# EAGLE design LTC3110 (EAGLE 7.1.0)
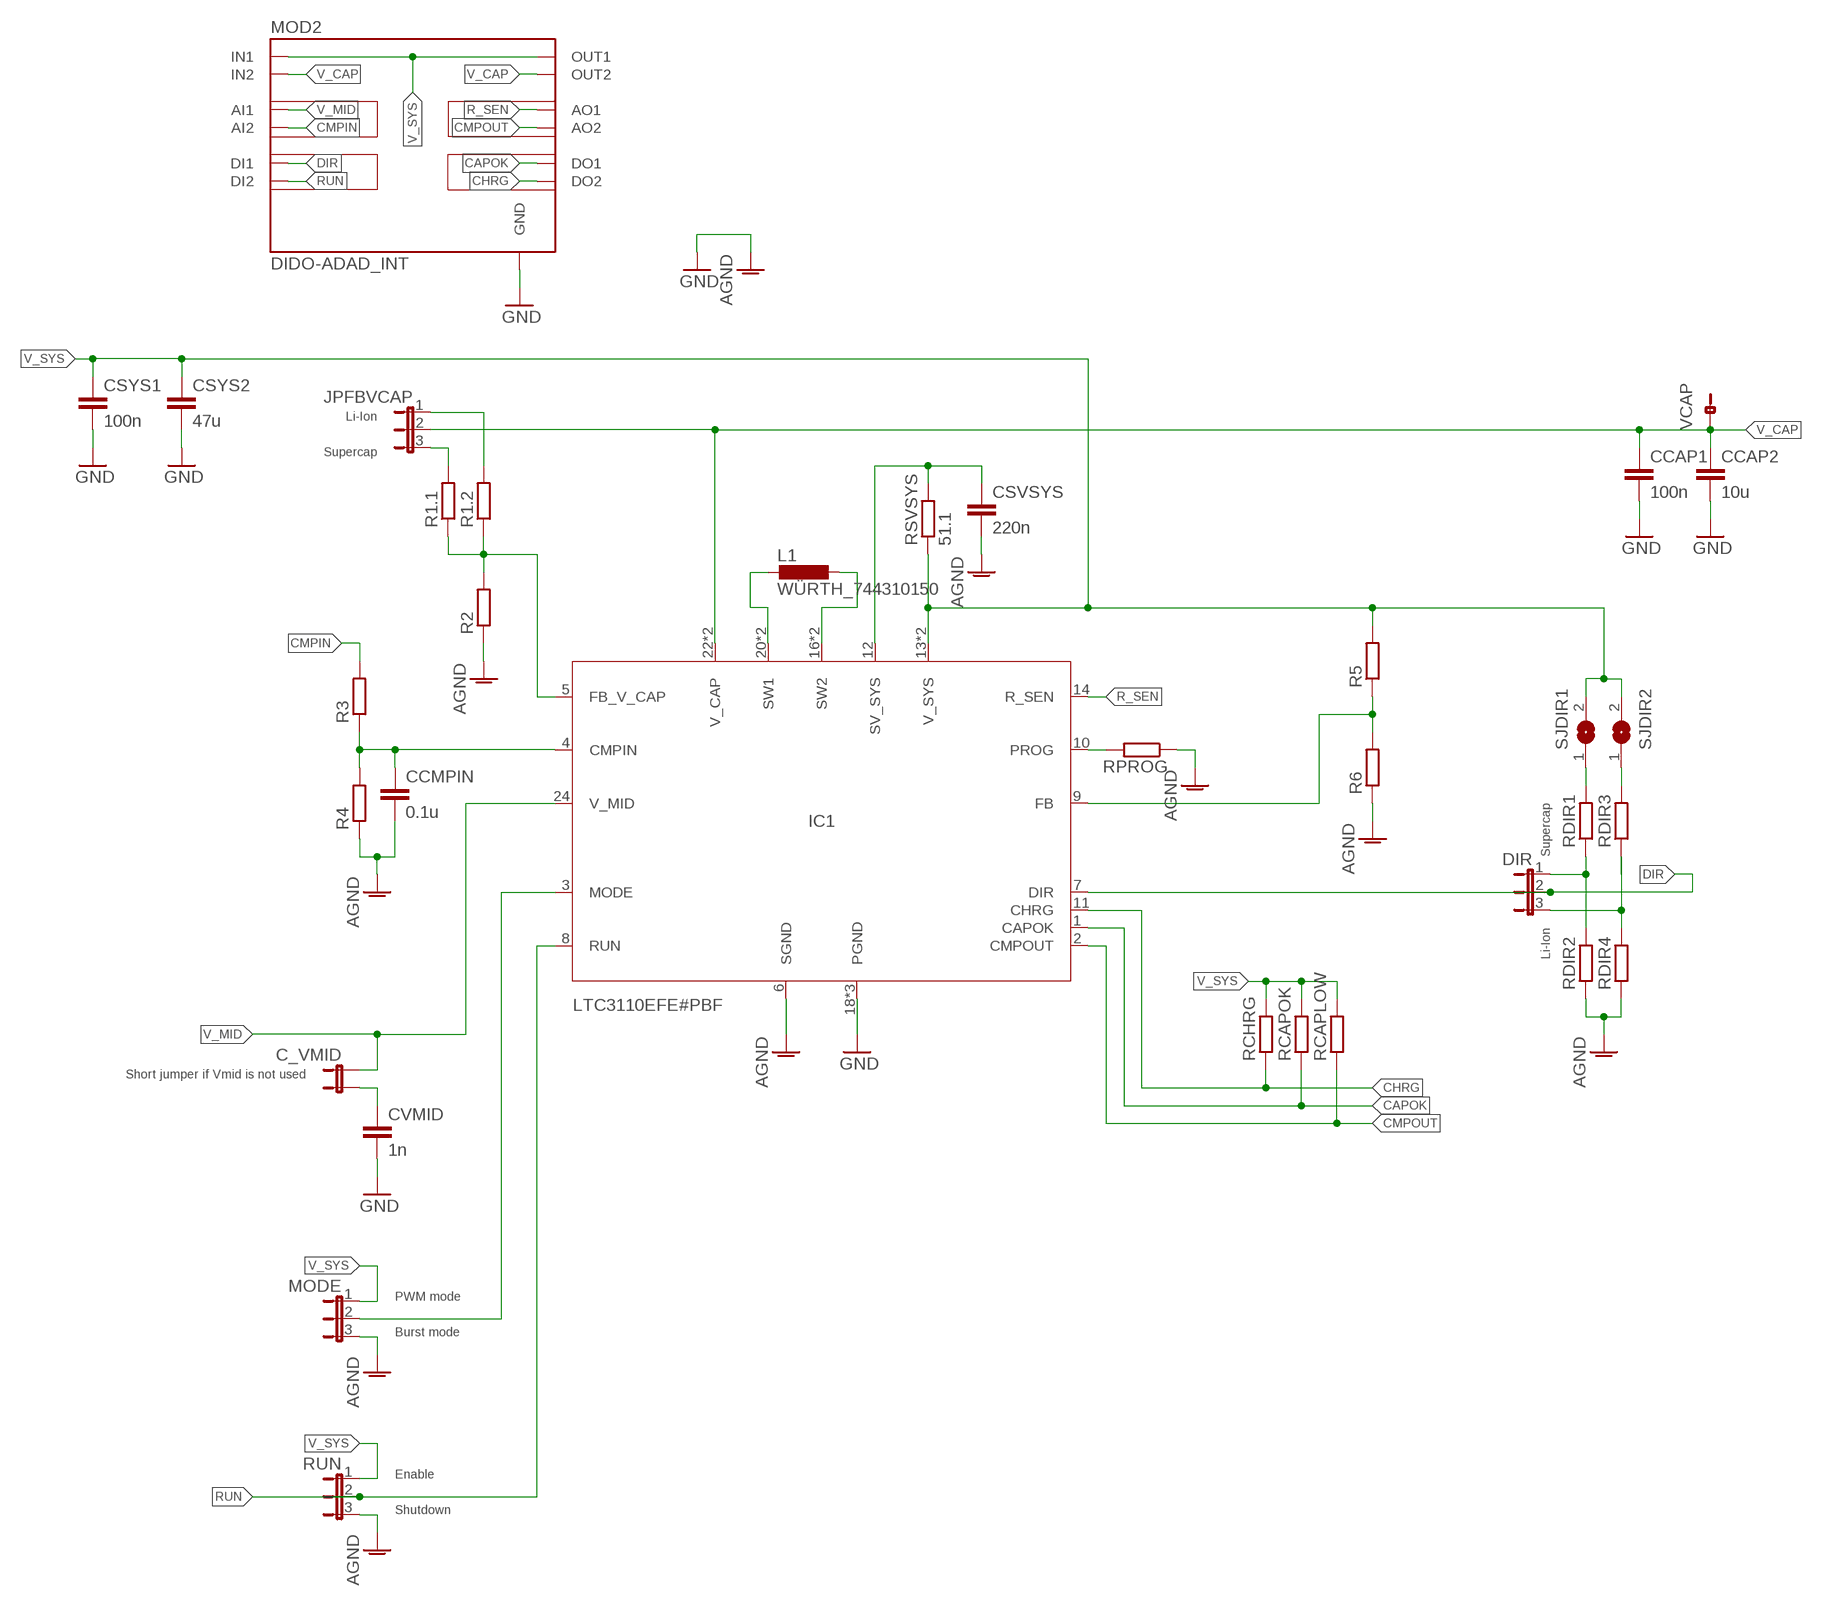
[diagram p0: schematic, sheet 1]

## Parts
C_VMID  JP2_SMALL_PAD  [JP2_SMALL_PAD]
CCAP1  100n  C-EUC0805  [C0805]
CCAP2  10u  C-EUC0805  [C0805]
CCMPIN  0.1u  C-EUC0805  [C0805]
CSVSYS  220n  C-EUC0805  [C0805]
CSYS1  100n  C-EUC0805  [C0805]
CSYS2  47u  C-EUC0805  [C0805]
CVMID  1n  C-EUC0805  [C0805]
DIR  JP3_SMALL_PAD  [JP3_SMALL_PAD]
IC1  LTC3110EFE#PBF  [TSSOP24-4,4MM]
JPFBVCAP  JP3_SMALL_PAD  [JP3_SMALL_PAD]
L1  WÜRTH_744310150  [WÜRTH_744310150]
MOD2  DIDO-ADAD_INT  [DIDO-ADAD]
MODE  JP3_SMALL_PAD  [JP3_SMALL_PAD]
R1.1  R-EU_R0805  [R0805]
R1.2  R-EU_R0805  [R0805]
R2  R-EU_R0805  [R0805]
R3  R-EU_R0805  [R0805]
R4  R-EU_R0805  [R0805]
R5  R-EU_R0805  [R0805]
R6  R-EU_R0805  [R0805]
RCAPLOW  R-EU_R0805  [R0805]
RCAPOK  R-EU_R0805  [R0805]
RCHRG  R-EU_R0805  [R0805]
RDIR1  R-EU_R0805  [R0805]
RDIR2  R-EU_R0805  [R0805]
RDIR3  R-EU_R0805  [R0805]
RDIR4  R-EU_R0805  [R0805]
RPROG  R-EU_R0805  [R0805]
RSVSYS  51.1  R-EU_R0805  [R0805]
RUN  JP3_SMALL_PAD  [JP3_SMALL_PAD]
SJDIR1  SJ2  [SJ2]
SJDIR2  SJ2  [SJ2]
VCAP  JPO  [JP0]

## Nets
AGND: CCMPIN.2 CSVSYS.2 IC1.6(SGND) MODE.3 R2.1 R4.1 R6.1 RDIR2.1 RDIR4.1 RPROG.1 RUN.3
CAPOK: IC1.1(CAPOK) MOD2.DO1 RCAPOK.1
CHRG: IC1.11(CHRG) MOD2.DO2 RCHRG.1
CMPIN: MOD2.AI2 R3.2
CMPOUT: IC1.2(CMPOUT) MOD2.AO2 RCAPLOW.1
DIR: DIR.2 IC1.7(DIR) MOD2.DI1
FB_V_CAP: IC1.5(FB_V_CAP) R1.1.1 R1.2.1 R2.2
GND: CCAP1.2 CCAP2.2 CSYS1.2 CSYS2.2 CVMID.2 IC1.18(PGND) IC1.19(PGND) IC1.TAB(PGND) MOD2.GND1(GND) MOD2.GND2(GND) MOD2.GND3(GND) MOD2.GND4(GND) ; supply symbol labelled AGND
MODE: IC1.3(MODE) MODE.2
N$1: C_VMID.2 CVMID.1
N$2: IC1.9(FB) R5.1 R6.2
N$3: CCMPIN.1 IC1.4(CMPIN) R3.1 R4.2
N$5: CSVSYS.1 IC1.12(SV_SYS) RSVSYS.2
N$6: DIR.3 RDIR3.1 RDIR4.2
N$7: IC1.20(SW1) IC1.21(SW1) L1.P$1
N$8: IC1.16(SW2) IC1.17(SW2) L1.P$2
N$9: IC1.10(PROG) RPROG.2
N$11: JPFBVCAP.3 R1.1.2
N$13: DIR.1 RDIR1.1 RDIR2.2
N$14: JPFBVCAP.1 R1.2.2
N$15: RDIR1.2 SJDIR1.1
N$16: RDIR3.2 SJDIR2.1
R_SEN: IC1.14(R_SEN) MOD2.AO1
RUN: IC1.8(RUN) MOD2.DI2 RUN.2
V_CAP: CCAP1.1 CCAP2.1 IC1.22(V_CAP) IC1.23(V_CAP) JPFBVCAP.2 MOD2.IN2_1(IN2) MOD2.IN2_2(IN2) MOD2.IN2_3(IN2) MOD2.IN2_4(IN2) MOD2.OUT2_1(OUT2) MOD2.OUT2_2(OUT2) MOD2.OUT2_3(OUT2) MOD2.OUT2_4(OUT2) VCAP.1
V_MID: C_VMID.1 IC1.24(V_MID) MOD2.AI1
V_SYS: CSYS1.1 CSYS2.1 IC1.13(V_SYS) IC1.15(V_SYS) MOD2.IN1_1(IN1) MOD2.IN1_2(IN1) MOD2.IN1_3(IN1) MOD2.IN1_4(IN1) MOD2.OUT1_1(OUT1) MOD2.OUT1_2(OUT1) MOD2.OUT1_3(OUT1) MOD2.OUT1_4(OUT1) MODE.1 R5.2 RCAPLOW.2 RCAPOK.2 RCHRG.2 RSVSYS.1 RUN.1 SJDIR1.2 SJDIR2.2

## Notes on the sheet
- Li-Ion
- Supercap
- Supercap
- Li-Ion
- Short jumper if Vmid is not used
- PWM mode
- Burst mode
- Enable
- Shutdown

## Library data of the parts
C_VMID = Jumper_mod:JP2_SMALL_PAD
CCAP1 CCAP2 CCMPIN CSVSYS CSYS1 CSYS2 CVMID = rcl:C-EU: CAPACITOR, European symbol
DIR JPFBVCAP MODE RUN = Jumper_mod:JP3_SMALL_PAD
IC1 = LTC3110:LTC3110EFE#PBF
L1 = Inductor:WÜRTH_744310150
MOD2 = AllModules:DIDO-ADAD_INT
R1.1 R1.2 R2-R6 RCAPLOW RCAPOK RCHRG RDIR1-RDIR4 RPROG RSVSYS = rcl:R-EU_: RESISTOR, European symbol
SJDIR1 SJDIR2 = Jumper_mod:SJ2: SMD solder JUMPER
VCAP = Jumper_mod:JPO

## Board
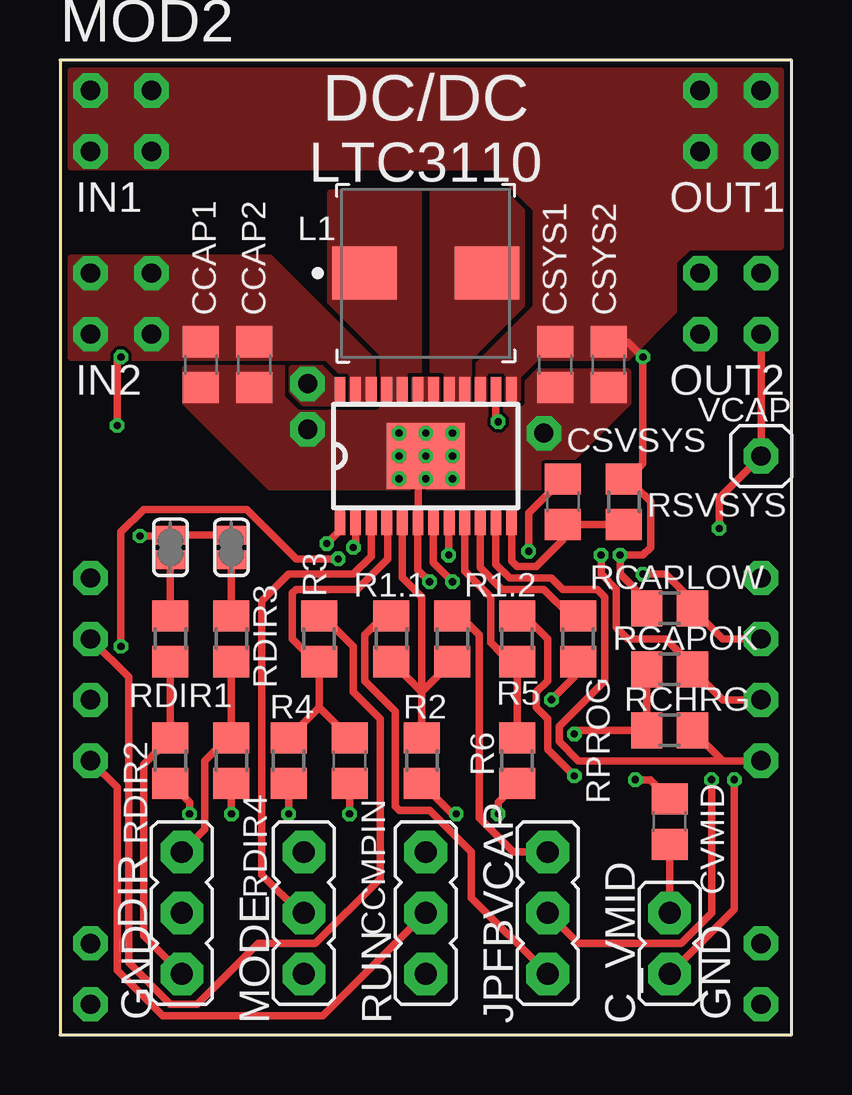
[diagram p1: board, top side]
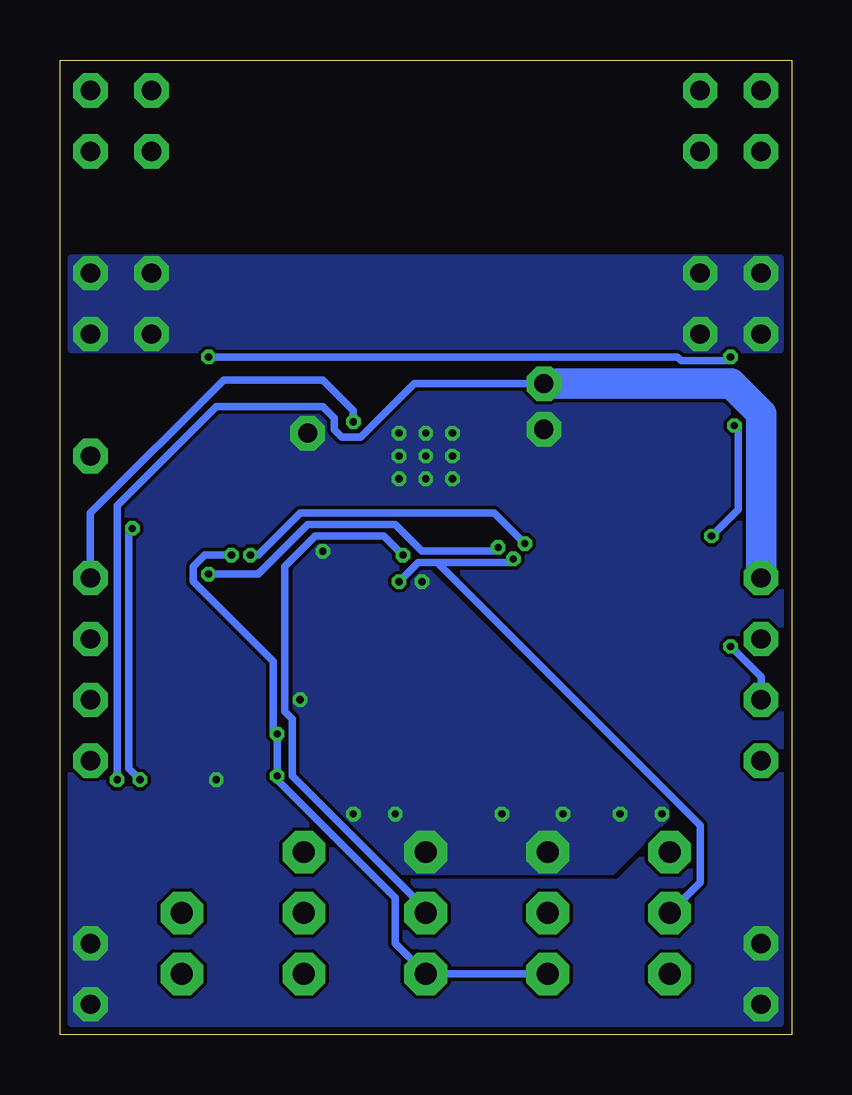
[diagram p2: board, bottom side, seen from below]

Size 30.48 x 40.64 mm. Coordinates in mm from the lower left corner, seen from the top.
Outline: 0,0 30.48,0 30.48,40.64 0,40.64 0,0
Copper layers (1*16): Top 0.035mm / dielectric 1.5mm / Bottom 0.035mm
Design rules "PCB-POOL Standard": minimum track width 0.15mm, minimum drill 0.3mm, track to track 0.15mm, track to pad 0.15mm, pad to pad 0.15mm, via to via 0.15mm, smd to smd 0.15mm, copper to edge 0.3mm, drill to drill 0.2mm, minimum pad ring 0.2mm, minimum via ring 0.15mm, stop-mask expansion 0.075mm, vias tented up to drill 0mil, thermal gap 0.2mm

### Footprints (pad centres in the part's own frame; a part is rotated, then mirrored left to right if it is on the bottom)
JP2_SMALL_PAD = drill 0.914 pad 1.778 octagon: 1 -2.54,0; 2 0,0
C0805 = smd 1.3 x 1.5: 1 -0.95,0; 2 0.95,0
JP3_SMALL_PAD = drill 0.914 pad 1.778 octagon: 1 -2.54,0; 2 0,0; 3 2.54,0
TSSOP24-4,4MM = smd 1.05 x 0.45: 1 -2.775,3.575; 2 -2.775,2.925; 3 -2.775,2.275; 4 -2.775,1.625; 5 -2.775,0.975; 6 -2.775,0.325; 7 -2.775,-0.325; 8 -2.775,-0.975; 9 -2.775,-1.625; 10 -2.775,-2.275; 11 -2.775,-2.925; 12 -2.775,-3.575; 13 2.775,-3.575; 14 2.775,-2.925; 15 2.775,-2.275; 16 2.775,-1.625; 17 2.775,-0.975; 18 2.775,-0.325; 19 2.775,0.325; 20 2.775,0.975; 21 2.775,1.625; 22 2.775,2.275; 23 2.775,2.925; 24 2.775,3.575 | smd 2.74 x 3.24: TAB 0,0
WÜRTH_744310150 = smd 2.7 x 2.2: P$1 -2.55,0; P$2 2.55,0
DIDO-ADAD = drill 0.8 pad 1.422 octagon: AI1 0,-20.32; AI2 0,-22.86; AO1 27.94,-20.32; AO2 27.94,-22.86; DI1 0,-25.4; DI2 0,-27.94; DO1 27.94,-25.4; DO2 27.94,-27.94; GND1 0,-38.1; GND2 0,-35.56; GND3 27.94,-35.56; GND4 27.94,-38.1; IN1_1 0,0; IN1_2 0,-2.54; IN1_3 2.54,0; IN1_4 2.54,-2.54; IN2_1 0,-7.62; IN2_2 0,-10.16; IN2_3 2.54,-7.62; IN2_4 2.54,-10.16; OUT1_1 25.4,0; OUT1_2 25.4,-2.54; OUT1_3 27.94,0; OUT1_4 27.94,-2.54; OUT2_1 25.4,-7.62; OUT2_2 25.4,-10.16; OUT2_3 27.94,-7.62; OUT2_4 27.94,-10.16
R0805 = smd 1.3 x 1.5: 1 -0.95,0; 2 0.95,0
SJ2 = smd 0.762 x 1.27: 1 -0.508,0; 2 0.508,0
JP0 = drill 0.8 pad 1.44 octagon: 1 0,0

### Placement (x,y rotation side)
C_VMID  25.4,5.08 90 top
CCAP1  5.87,27.94 270 top
CCAP2  8.1,27.94 270 top
CCMPIN  12.06,11.43 270 top
CSVSYS  20.95,22.23 90 top
CSYS1  20.64,27.94 270 top
CSYS2  22.86,27.94 270 top
CVMID  25.4,8.89 90 top
DIR  5.08,5.08 90 top
IC1  15.24,24.13 90 top
JPFBVCAP  20.32,5.08 270 top
L1  15.24,31.75 0 top
MOD2  1.27,39.37 0 top
MODE  10.16,5.08 90 top
R1.1  13.81,16.51 90 top
R1.2  16.35,16.51 90 top
R2  15.08,11.43 90 top
R3  10.79,16.51 90 top
R4  9.53,11.43 90 top
R5  19.05,16.51 90 top
R6  19.05,11.43 90 top
RCAPLOW  25.4,17.78 180 top
RCAPOK  25.4,15.24 180 top
RCHRG  25.4,12.7 180 top
RDIR1  4.6,16.51 90 top
RDIR2  4.6,11.43 90 top
RDIR3  7.14,16.51 90 top
RDIR4  7.14,11.43 90 top
RPROG  21.59,16.51 90 top
RSVSYS  23.5,22.23 270 top
RUN  15.24,5.08 90 top
SJDIR1  4.6,20.32 90 top
SJDIR2  7.14,20.32 90 top
VCAP  29.21,24.13 0 top

### Tracks (layer width: path | path; a pad name or v marks a point on that pad's centre or on a via)
AGND  (via drill 0.3)
  Top 0.305: v12.06,9.21 CCMPIN.2 | RPROG.1 21.43,15.56 21.43,14.93 v20.48,13.97 | RDIR2.1 5.4,9.69 v5.4,9.21 | RDIR4.1 v7.14,9.21 | R4.1 v9.53,9.21 | R2.1 16.35,9.21 v16.51,9.21 | IC1.6 14.91,19.38 v15.4,18.89 | v18.26,9.21 18.26,9.69 R6.1 | v19.53,20.16 19.53,21.75 20.16,22.38 CSVSYS.2
  pour Bottom (no thermals): 5.24,9.53 5.24,9.05 7.46,6.83 17.14,6.83 20.64,10.32 20.64,19.37 19.68,20.32 16.35,20.32 15.08,19.21
CAPOK  (via drill 0.3)
  Top 0.305: MOD2.DO1 27.62,13.97 RCAPOK.1 26.04,15.55 26.04,15.72 25.24,16.51 23.65,16.51 23.18,16.99 23.18,18.57 22.54,19.21 v22.54,20 | IC1.1 11.66,21.03 v11.11,20.48
  Bottom 0.305: v11.11,20.48 12.38,21.75 20.48,21.75 22.23,20 v22.54,20
CHRG
  Top 0.305: RCHRG.1 27.62,11.43 MOD2.DO2 21.59,11.43 20.8,12.22 20.8,12.86 22.7,14.76 22.7,18.26 22.38,18.57 20.95,18.57 20.48,19.05 18.73,19.05 18.16,19.62 IC1.11
CMPIN
  Top 0.305: MOD2.AI2 2.86,14.92 2.86,3.02 4.6,1.27 5.71,1.27 8.26,3.81 10.64,3.81 13.34,6.51 13.34,13.18 12.22,14.29 12.22,16.19 10.96,17.46 R3.2
CMPOUT  (via drill 0.3)
  Top 0.305: MOD2.AO2 27.62,16.51 RCAPLOW.1 26.19,17.94 26.19,18.26 25.24,19.21 v24.29,19.21 | IC1.2 12.31,20.41 v12.22,20.32
  Bottom 0.305: v12.22,20.32 12.38,20.16 15.4,20.16 16.51,21.27 20.16,21.27 22.23,19.21 v24.29,19.21
DIR  (via drill 0.3)
  Top 0.305: IC1.7 15.56,19.69 v16.35,18.89 | v11.59,19.84 9.84,19.84 7.78,21.91 3.49,21.91 2.54,20.96 v2.54,16.19
  Bottom 0.305: v16.35,18.89 15.56,19.69 14.76,19.69 | 14.76,19.69 11.75,19.69 v11.59,19.84 | v2.54,16.19 1.27,14.92 MOD2.DI1 | DIR.2 3.81,6.35 3.81,8.73 14.76,19.69
FB_V_CAP
  Top 0.305: R1.1.1 15.08,14.29 | R1.2.1 15.08,14.29 | IC1.5 14.27,19.07 15.08,18.26 15.08,14.29 | 15.08,14.29 R2.2
GND  (via drill 0.3, 0.8)
  Top 0.305: v23.97,10.64 24.6,10.64 CVMID.2
  other vias: 10.32,25.24 20.16,25.08 14.13,25.08 15.24,25.08 16.35,25.08 16.35,24.13 15.24,24.13 14.13,24.13 14.13,23.18 15.24,23.18 16.35,23.18
  pour Top (rank 3, no thermals): 5.24,26.35 8.73,22.86 20.16,22.86 23.65,26.35 23.65,27.62 19.53,27.62 18.26,26.04 15.72,26.04 15.72,27.3 14.76,27.3 14.76,26.04 12.7,26.04 10.95,27.78 5.24,27.78
  pour Bottom (rank 2, no thermals): 0.48,40.16 30,40.16 30,0.48 0.48,0.48
MODE
  Top 0.305: IC1.3 12.96,19.95 12.22,19.21 9.53,19.21 8.41,18.1 8.41,6.67 10,5.08 MODE.2
N$1
  Top 0.305: C_VMID.2 CVMID.1
N$2
  Top 0.305: R6.2 R5.1 18.73,15.88 18.41,15.88 17.94,16.35 17.94,18.26 16.86,19.33 IC1.9
N$3
  Top 0.305: 10.79,13.65 R4.2 | 10.79,13.65 R3.1 10.63,15.56 9.68,16.51 9.68,18.41 9.84,18.57 12.38,18.57 13.65,19.84 13.65,21.32 IC1.4 | 10.79,13.65 CCMPIN.1
N$4
  Top 0.305: 14.92,21.27 14.92,23.34
N$5
  Top 0.305: RSVSYS.2 CSVSYS.1 20.95,20.64 19.84,19.53 19.05,19.53 18.82,19.76 IC1.12
N$6
  Top 0.305: RDIR3.1 RDIR4.2 6.67,11.91 6.51,11.91 6.03,11.43 6.03,8.57 DIR.3
N$7
  pour Top (rank 4, no thermals): 11.27,35.08 11.27,29.84 13.49,27.62 13.49,26.35 14.92,26.35 14.92,35.08
N$8
  pour Top (rank 4, no thermals): 19.21,35.08 15.56,35.08 15.56,26.35 17.14,26.35 17.14,27.62 19.21,29.69
N$9
  Top 0.305: IC1.10 17.52,19.47 18.41,18.57 20.16,18.57 21.27,17.46 RPROG.2
N$11
  Top 0.305: R1.1.2 13.49,17.46 12.7,16.67 12.7,14.76 13.97,13.49 13.97,9.53 14.13,9.37 15.4,9.37 17.14,7.62 17.14,5.72 JPFBVCAP.3
N$13
  Top 0.305: RDIR1.1 RDIR2.2 3.49,11.27 3.49,4.13 DIR.1
N$14
  Top 0.305: R1.2.2 16.67,17.46 17.46,16.67 17.46,9.05 18.89,7.62 JPFBVCAP.1
N$15
  Top 0.305: SJDIR1.1 RDIR1.2
N$16
  Top 0.305: SJDIR2.1 RDIR3.2
R_SEN  (via drill 0.3)
  Top 0.305: IC1.14 18.16,25.65 v18.26,25.56
  Bottom 0.305: v18.26,25.56 18.26,26.04 19.53,27.3 23.65,27.3 29.21,21.75 MOD2.AO1
RUN  (via drill 0.3)
  Top 0.305: IC1.8 16.19,21.33 v16.19,20 | MOD2.DI2 2.38,10.32 2.38,2.7 4.29,0.79 10.95,0.79 RUN.2
  Bottom 0.305: v16.19,20 16.99,20.8 19.84,20.8 21.11,19.53 21.11,13.49 20.8,13.18 20.8,10.8 15.24,5.24 RUN.2
V_CAP  (via drill 0.3)
  Top 0.305: MOD2.OUT2_4 VCAP.1 27.46,22.38 v27.46,21.11 | v27.15,10.64 27.15,5.08 25.88,3.81 21.59,3.81 JPFBVCAP.2
  Bottom 0.305: v27.46,21.11 27.62,20.96 27.62,11.11 v27.15,10.64
  pour Bottom (no thermals): 0.48,28.58 0.48,32.38 30,32.38 30,28.58
  pour Top (no thermals): 0.48,32.38 0.48,28.26 11.11,28.26 12.06,27.3 12.06,26.35 13.02,26.35 13.02,28.1 8.73,32.38
V_MID  (via drill 0.3, 0.8)
  Top 0.305: C_VMID.1 28.1,5.24 v28.1,10.64
  Bottom 0.305: v10.32,27.15 15.72,27.15 17.94,24.92 18.73,24.92 19.05,25.24 19.05,25.72 19.53,26.19 23.97,26.19 28.1,22.07 v28.1,10.64
  Bottom 1.27: MOD2.AI1 1.27,25.91 2.51,27.15 v10.32,27.15
  pour Top (rank 2, no thermals): 11.75,26.35 10.16,26.35 9.68,26.83 9.68,27.78 11.43,27.78 11.75,27.46
V_SYS  (via drill 0.3)
  Top 0.305: v21.43,12.54 21.59,12.7 RCHRG.2 RCAPOK.2 | R5.2 19.37,17.46 20.32,16.51 20.32,14.76 19.84,14.29 19.84,13.65 20.32,13.18 20.32,11.91 v21.43,10.8 | CSYS2.1 23.66,28.89 v24.29,28.26 24.29,23.81 24.13,23.65 23.97,23.65 RSVSYS.1 23.81,22.86 23.97,22.86 24.61,22.23 24.61,20.32 24.29,20 v23.34,20 23.34,19.21 24.45,18.09 RCAPLOW.2 | 5.87,20.83 SJDIR2.2 SJDIR1.2 4.57,20.8 v3.33,20.8 | v2.54,28.26 2.38,28.1 v2.38,25.4
  Bottom 0.305: MODE.1 RUN.1 16.51,3.81 16.51,5.72 21.43,10.64 v21.43,10.8 v21.43,12.54 21.59,12.7 21.59,15.56 24.92,18.89 24.92,19.53 24.45,20 v23.34,20 | v2.54,28.26 2.7,28.1 4.6,28.1 4.76,28.26 v24.29,28.26 | v3.33,20.8 2.22,21.91 2.22,25.4 v2.38,25.4
  pour Top (no thermals): 0.48,40.16 0.48,36.2 30,36.2 30,40.16
  pour Top (no thermals): 17.46,26.51 17.46,27.94 19.84,30.32 19.84,34.45 18.1,36.2 18.1,40.16 30,40.16 30,32.86 26.19,32.86 25.56,32.23 25.56,30.16 23.65,28.26 19.84,28.26 19.05,27.46 19.05,26.51

### Text on the board
tNames: DC/DC | LTC3110
bStop: Beckedahl & Kokert / 18.09.2015